# EAGLE design remote_light (EAGLE 7.2.0)
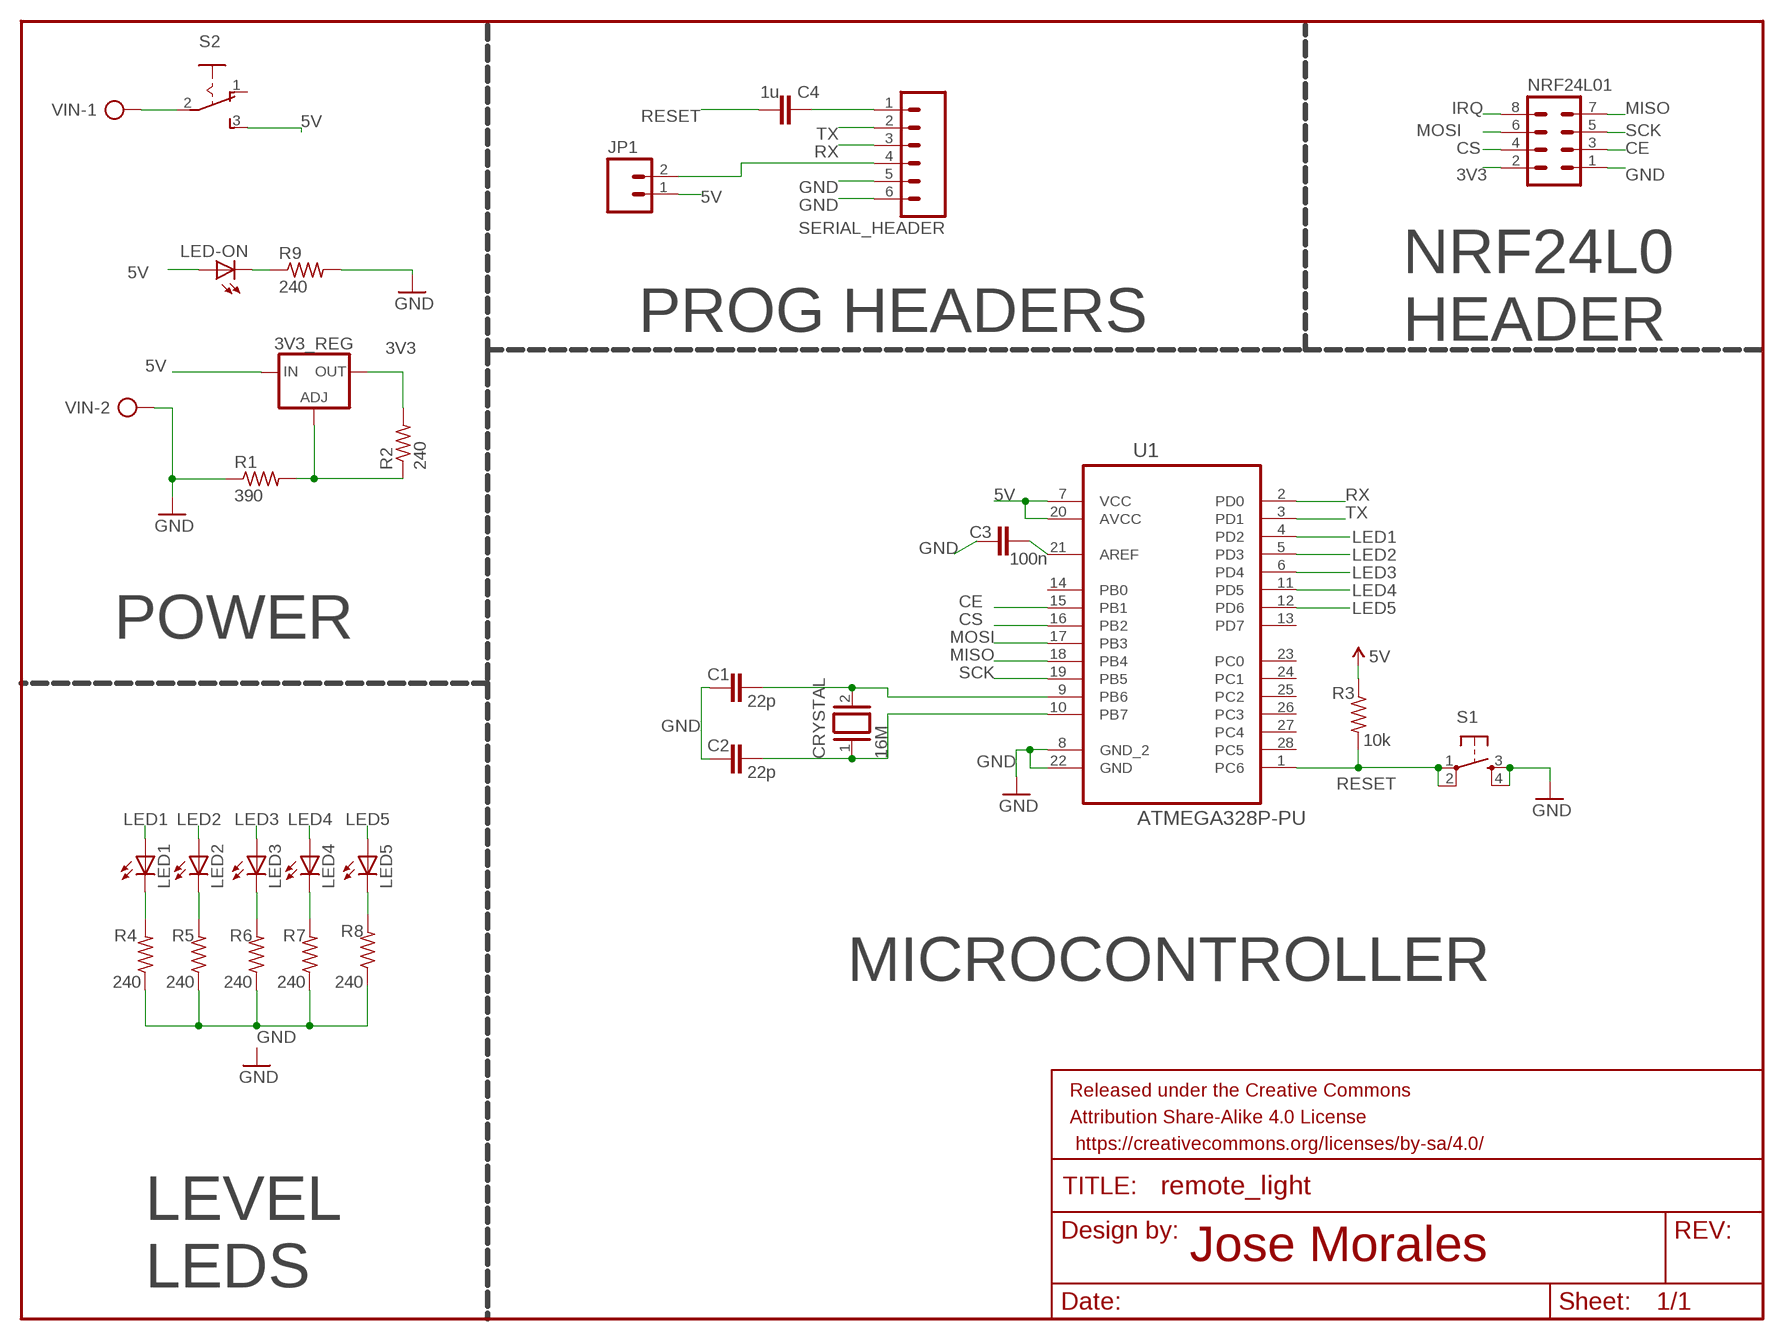
[diagram p0: schematic, sheet 1]

## Parts
C1  22p  C-EU050-025X075  [C050-025X075]
C2  22p  C-EU050-025X075  [C050-025X075]
C3  100n  C-EU050-025X075  [C050-025X075]
C4  1u  C-EU050-025X075  [C050-025X075]
CRYSTAL  16M  XTAL/S  [QS]
FRAME11  FRAME-LETTER  [CREATIVE_COMMONS]
JP1  M02LOCK  [1X02_LOCK]
LED1  LED5MM  [LED5MM]
LED2  LED5MM  [LED5MM]
LED3  LED5MM  [LED5MM]
LED4  LED5MM  [LED5MM]
LED5  LED5MM  [LED5MM]
LED-ON  LED5MM  [LED5MM]
LM317  3V3_REG  LM317TS  [317TS]
NRF24L01  MA04-2  [MA04-2]
R1  390  R-US_0207/12  [0207/12]
R2  240  R-US_0207/12  [0207/12]
R3  10k  R-US_0207/12  [0207/12]
R4  240  R-US_0207/12  [0207/12]
R5  240  R-US_0207/12  [0207/12]
R6  240  R-US_0207/12  [0207/12]
R7  240  R-US_0207/12  [0207/12]
R8  240  R-US_0207/12  [0207/12]
R9  240  R-US_0207/12  [0207/12]
S1  TAC_SWITCHPTH  [TACTILE-PTH]
S2  255SB  [255SB]
SERIAL_HEADER  M06POLAR  [MOLEX-1X6]
U1  ATMEGA328P-PU  [DIP254P762X457-28]
VIN  AK300/2  [AK300/2]

## Nets
3V3: LM317.2(OUT) NRF24L01.2 R2.2
5V: JP1.1 LED-ON.A LM317.3(IN) R3.1 S2.3(S) U1.7(VCC) U1.20(AVCC)
CE: NRF24L01.3 U1.15(PB1)
CS: NRF24L01.4 U1.16(PB2)
GND: C1.2 C2.2 C3.2 NRF24L01.1 R1.1 R4.1 R5.1 R6.1 R7.1 R8.1 R9.2 S1.3 S1.4 SERIAL_HEADER.5 SERIAL_HEADER.6 U1.8(GND_2) U1.22(GND) VIN.2
IRQ: NRF24L01.8
LED1: LED1.A U1.4(PD2)
LED2: LED2.A U1.5(PD3)
LED3: LED3.A U1.6(PD4)
LED4: LED4.A U1.11(PD5)
LED5: LED5.A U1.12(PD6)
MISO: NRF24L01.7 U1.18(PB4)
MOSI: NRF24L01.6 U1.17(PB3)
N$1: LM317.1(ADJ) R1.2 R2.1
N$2: C1.1 CRYSTAL.2 U1.9(PB6)
N$3: LED1.K(C) R4.2
N$4: LED-ON.K(C) R9.1
N$5: C2.1 CRYSTAL.1 U1.10(PB7)
N$6: LED2.K(C) R5.2
N$7: LED3.K(C) R6.2
N$8: LED4.K(C) R7.2
N$9: LED5.K(C) R8.2
N$10: C3.1 U1.21(AREF)
N$14: C4.2 SERIAL_HEADER.1
N$15: S2.2(P) VIN.1
N$17: JP1.2 SERIAL_HEADER.4
RESET: C4.1 R3.2 S1.1 S1.2 U1.1(PC6)
RX: SERIAL_HEADER.3 U1.2(PD0)
SCK: NRF24L01.5 U1.19(PB5)
TX: SERIAL_HEADER.2 U1.3(PD1)
Unconnected: S2.1(O) U1.13(PD7) U1.14(PB0) U1.23(PC0) U1.24(PC1) U1.25(PC2) U1.26(PC3) U1.27(PC4) U1.28(PC5)

## Notes on the sheet
- PROG HEADERS
- NRF24L0
  HEADER
- POWER
- MICROCONTROLLER
- Jose Morales
- LEVEL
  LEDS

## Library data of the parts
C1-C4 = rcl:C-EU: CAPACITOR, European symbol
CRYSTAL = special:XTAL/S: CRYSTAL
FRAME11 = SparkFun-Aesthetics:FRAME-LETTER: Schematic Frame Standard 8.5x11 US Letter frame; DESIGNER: NAME; VERSION: v01
JP1 = SparkFun-Connectors:M02: Standard 2-pin 0.1" header. Use with - straight break away headers ( PRT-00116) - right angle break away headers (PRT-00553) - swiss pins (PRT-00743) - machine pins (PRT-00117) - female headers (PRT-00115) Molex polarized connector foot print use with: PRT-08233 with associated crimp pins and housings. 2.54_SCREWTERM for use with PRT-10571. 3.5mm Screw Terminal footprints for PRT-08084 5mm Screw Terminal footprints for use with PRT-08432
LED1-LED5 LED-ON = led:LED: LED OSRAM: - CHIPLED LG R971, LG N971, LY N971, LG Q971, LY Q971, LO R971, LY R971 LH N974, LH R974 LS Q976, LO Q976, LY Q976 LO Q996 - Hyper CHIPLED LW Q18S LB Q993, LB Q99A, LB R99A - SideLED LS A670, LO A670, LY A670, LG A670, LP A670 LB A673, LV A673, LT A673, LW A673 LH A674 LY A675 LS A676, LA A676, LO A676, LY A676, LW A676 LS A679, LY A679, LG A679 - Hyper Micro SIDELED® LS Y876, LA Y876, LO Y876, LY Y876 LT Y87S - SmartLED LW L88C, LW L88S LB L89C, LB L89S, LG L890 LS L89K, LO L89K, LY L89K LS L896, LA L896, LO L896, LY L896 - TOPLED LS T670, LO T670, LY T670, LG T670, LP T670 LSG T670, LSP T670, LSY T670, LOP T670, LYG T670 LG T671, LOG T671, LSG T671 LB T673, LV T673, LT T673, LW T673 LH T674 LS T676, LA T676, LO T676, LY T676, LB T676, LH T676, LSB T676, LW T676 LB T67C, LV T67C, LT T67C, LS T67K, LO T67K, LY T67K, LW E67C LS E67B, LA E67B, LO E67B, LY E67B, LB E67C, LV E67C, LT E67C LW T67C LS T679, LY T679, LG T679 LS T770, LO T770, LY T770, LG T770, LP T770 LB T773, LV T773, LT T773, LW T773 LH T774 LS E675, LA E675, LY E675, LS T675 LS T776, LA T776, LO T776, LY T776, LB T776 LHGB T686 LT T68C, LB T68C - Hyper Mini TOPLED® LB M676 - Mini TOPLED Santana® LG M470 LS M47K, LO M47K, LY M47K Source: http://www.osram.convergy.de LUXEON: - LUMILED® LXK2-PW12-R00, LXK2-PW12-S00, LXK2-PW14-U00, LXK2-PW14-V00 LXK2-PM12-R00, LXK2-PM12-S00, LXK2-PM14-U00 LXK2-PE12-Q00, LXK2-PE12-R00, LXK2-PE12-S00, LXK2-PE14-T00, LXK2-PE14-U00 LXK2-PB12-K00, LXK2-PB12-L00, LXK2-PB12-M00, LXK2-PB14-N00, LXK2-PB14-P00, LXK2-PB14-Q00 LXK2-PR12-L00, LXK2-PR12-M00, LXK2-PR14-Q00, LXK2-PR14-R00 LXK2-PD12-Q00, LXK2-PD12-R00, LXK2-PD12-S00 LXK2-PH12-R00, LXK2-PH12-S00 LXK2-PL12-P00, LXK2-PL12-Q00, LXK2-PL12-R00 Source: www.luxeon.com KINGBRIGHT: KA-3528ASYC Source: www.kingbright.com
LM317 = v-reg:LM317TS: VOLTAGE REGULATOR
NRF24L01 = con-lstb:MA04-2: PIN HEADER; OC_FARNELL: unknown; OC_NEWARK: unknown
R1-R9 = resistor:R-US_: RESISTOR, American symbol
S1 = SparkFun-Retired:TAC_SWITCH: Momentary Switch Button commonly used for reset or general input. Spark Fun Electronics SKU : COM-00097 SMT- SWCH-08247
S2 = switch:255SB: SLIDING SWITCH Distributor Buerklin, 11G810
SERIAL_HEADER = SparkFun-Connectors:M06: Header 6 Standard 6-pin 0.1" header. Use with straight break away headers (SKU : PRT-00116), right angle break away headers (PRT-00553), swiss pins (PRT-00743), machine pins (PRT-00117), and female headers (PRT-00115). Molex polarized connector foot print use with SKU : PRT-08094 with associated crimp pins and housings. NOTES ON THE VARIANTS LOCK and LOCK_LONGPADS... This footprint was designed to help hold the alignment of a through-hole component (i.e. 6-pin header) while soldering it into place. You may notice that each hole has been shifted either up or down by 0.005 of an inch from it's more standard position (which is a perfectly straight line). This slight alteration caused the pins (the squares in the middle) to touch the edges of the holes. Because they are alternating, it causes a "brace" to hold the component in place. 0.005 has proven to be the perfect amount of "off-center" position when using our standard breakaway headers. Although looks a little odd when you look at the bare footprint, once you have a header in there, the alteration is very hard to notice. Also,if you push a header all the way into place, it is covered up entirely on the bottom side. This idea of altering the position of holes to aid alignment will be further integrated into the Sparkfun Library for other footprints. It can help hold any component with 3 or more connection pins.
U1 = Atmel_By_element14_Batch_1-00:ATMEGA328P-PU: 8-bit Microcontroller with In-System Programmable Flash; MPN: ATMEGA328P-PU; OC_FARNELL: 1715487; OC_NEWARK: 15R0268; PACKAGE: PDIP-28; SUPPLIER: Atmel
VIN = con-ptr500:AK300/2: CONNECTOR; OC_FARNELL: unknown; OC_NEWARK: unknown

## Net classes
0 default: clearance 0.205 mm

## Board
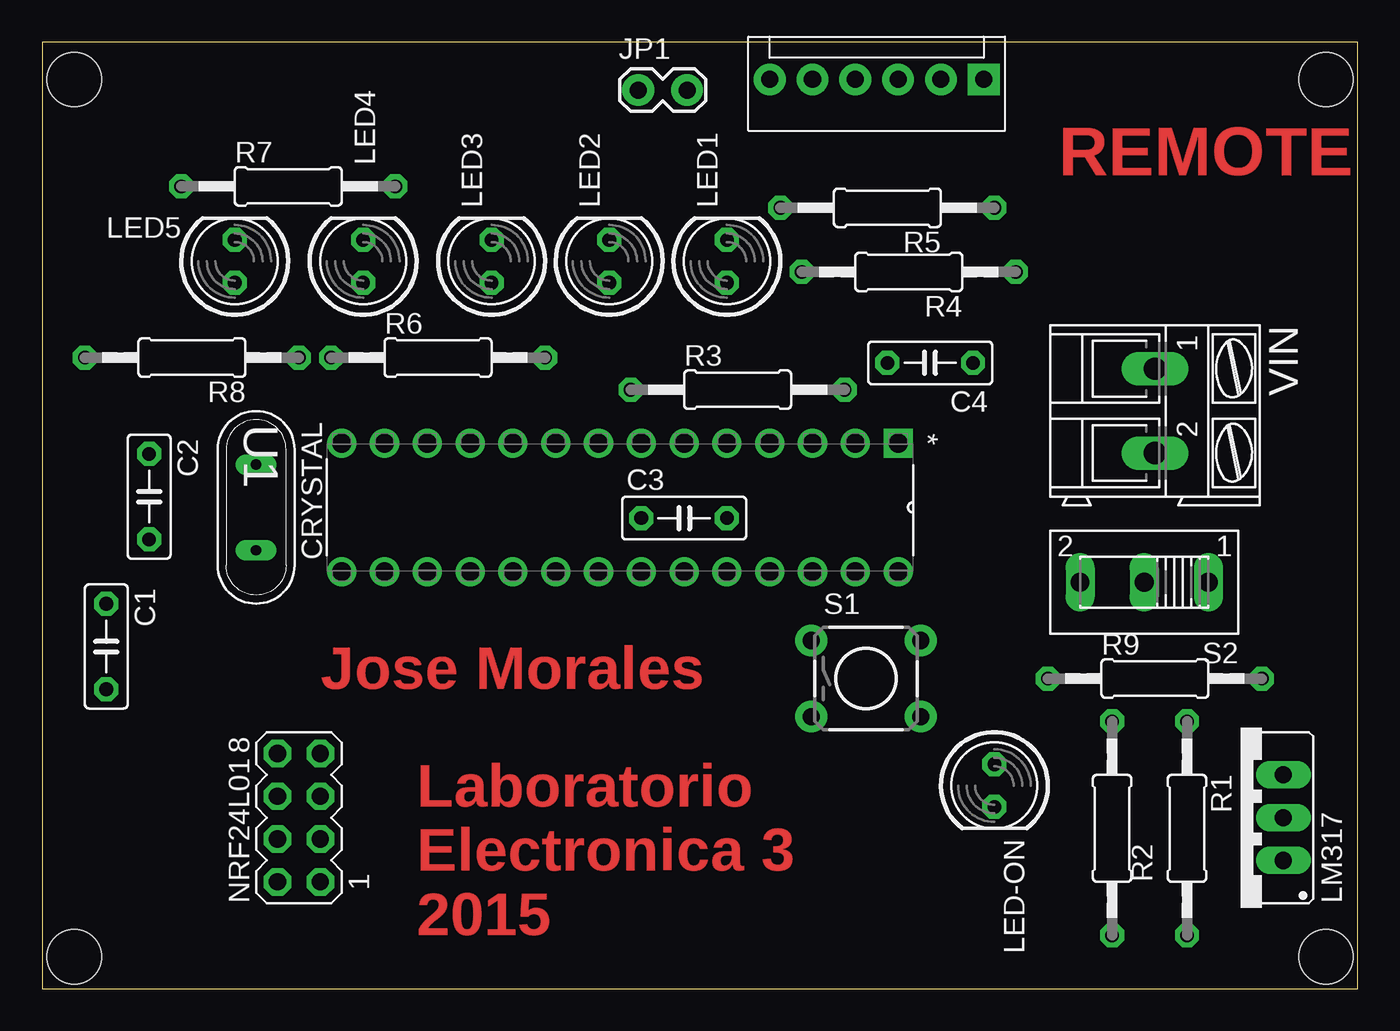
[diagram p1: board, top side]
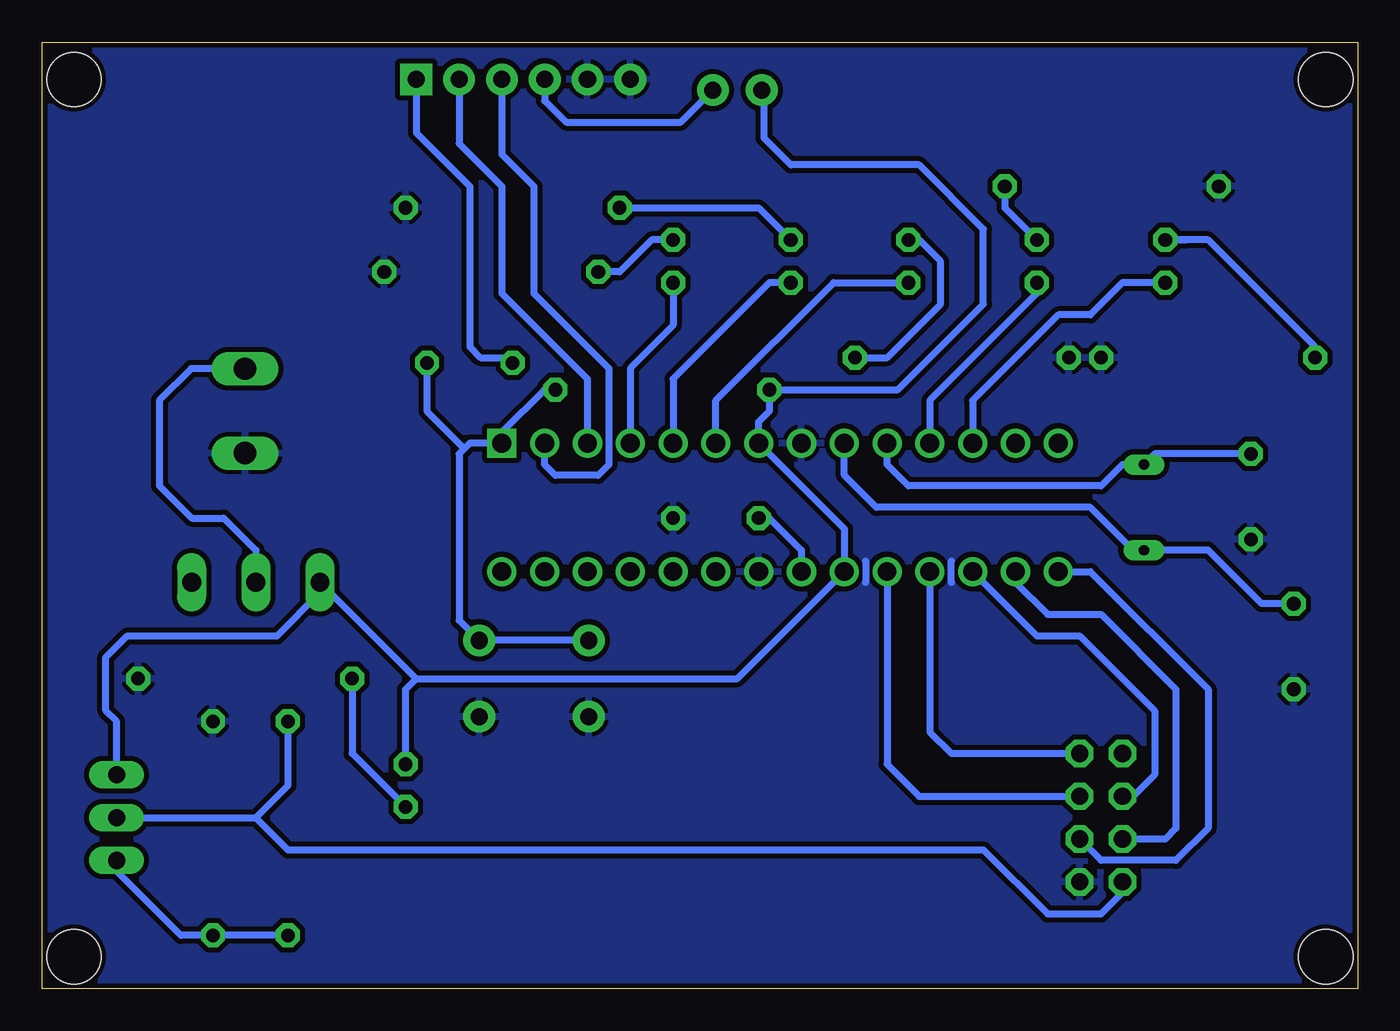
[diagram p2: board, bottom side, seen from below]

Size 78.08 x 56.19 mm. Coordinates in mm from the lower left corner, seen from the top.
Outline: 0,0 78.08,0 78.08,56.19 0,56.19 0,0
Copper layers (1*16): Top 0.035mm / dielectric 1.5mm / Bottom 0.035mm
Design rules "SparkFun *": minimum track width 8mil, minimum drill 20mil, track to track 12mil, track to pad 8mil, pad to pad 8mil, via to via 8mil, smd to smd 8mil, copper to edge 10mil, drill to drill 8mil, minimum pad ring 12mil, minimum via ring 10mil, stop-mask expansion 4mil, vias tented up to drill 25mil, thermal gap 10mil
Holes 3.2 mm at 1.91,53.98 1.91,1.91 76.2,1.91 76.2,53.98

### Footprints (pad centres in the part's own frame; a part is rotated, then mirrored left to right if it is on the bottom)
C050-025X075 = drill 0.813 octagon: 1 -2.54,0; 2 2.54,0
QS = drill 0.61 long: 1 -2.54,0; 2 2.54,0
1X02_LOCK = drill 1.016 pad 1.88: 1 -0.178,0; 2 2.718,0
LED5MM = drill 0.813 octagon: A -1.27,0; K 1.27,0
317TS = drill 1.016 long: 1 -2.54,-2.54; 2 0,-2.54; 3 2.54,-2.54
MA04-2 = drill 1.016 octagon: 1 -3.81,-1.27; 2 -3.81,1.27; 3 -1.27,-1.27; 4 -1.27,1.27; 5 1.27,-1.27; 6 1.27,1.27; 7 3.81,-1.27; 8 3.81,1.27
0207/12 = drill 0.813 octagon: 1 -6.35,0; 2 6.35,0
TACTILE-PTH = drill 1.016 pad 1.88: 1 -3.251,2.261; 2 3.251,2.261; 3 -3.251,-2.261; 4 3.251,-2.261
255SB = drill 1.118 long: 1 -3.81,0; 2 0,0; 3 3.81,0
MOLEX-1X6 = drill 1.016 pad 1.88 square: 1 0,0 | drill 1.016 pad 1.88: 2 2.54,0; 3 5.08,0; 4 7.62,0; 5 10.16,0; 6 12.7,0
DIP254P762X457-28 = drill 1.118 square: 1 -7.62,33.02 | drill 1.118: 2 -7.62,30.48; 3 -7.62,27.94; 4 -7.62,25.4; 5 -7.62,22.86; 6 -7.62,20.32; 7 -7.62,17.78; 8 -7.62,15.24; 9 -7.62,12.7; 10 -7.62,10.16; 11 -7.62,7.62; 12 -7.62,5.08; 13 -7.62,2.54; 14 -7.62,0; 15 0,0; 16 0,2.54; 17 0,5.08; 18 0,7.62; 19 0,10.16; 20 0,12.7; 21 0,15.24; 22 0,17.78; 23 0,20.32; 24 0,22.86; 25 0,25.4; 26 0,27.94; 27 0,30.48; 28 0,33.02
AK300/2 = drill 1.321 long: 1 -2.515,0; 2 2.489,0

### Placement (x,y rotation side)
C1  3.81,20.32 270 top
C2  6.35,29.21 270 top
C3  38.1,27.94 0 top
C4  52.7,37.15 180 top
CRYSTAL  12.7,28.57 270 top
FRAME11  20.95,-17.14 0 top  (outside the outline)
JP1  35.56,53.34 0 top
LED1  40.64,43.18 90 top
LED2  33.66,43.18 90 top
LED3  26.67,43.18 90 top
LED4  19.05,43.18 90 top
LED5  11.43,43.18 90 top
LED-ON  56.52,12.06 270 top
LM317  71.12,10.16 90 top
NRF24L01  15.24,10.16 90 top
R1  67.94,9.53 270 top
R2  63.5,9.53 90 top
R3  41.27,35.56 0 top
R4  51.44,42.55 180 top
R5  50.16,46.35 180 top
R6  23.5,37.47 0 top
R7  14.61,47.62 0 top
R8  8.89,37.47 180 top
R9  66.04,18.41 0 top
S1  48.9,18.41 0 top
S2  65.41,24.13 180 top
SERIAL_HEADER  55.88,53.98 180 top
U1  17.78,24.77 270 top
VIN  66.04,34.29 270 top

### Tracks (layer width: path | path; a pad name or v marks a point on that pad's centre or on a via)
3V3
  Bottom 0.406: NRF24L01.2 13.97,5.71 15.24,4.45 18.41,4.45 22.23,8.26 63.5,8.26 65.41,10.16 | LM317.2 65.41,10.16 | R2.2 63.5,12.06 65.41,10.16
5V
  Bottom 0.406: 55.88,18.41 36.83,18.41 U1.20 30.48,27.3 U1.7 35.56,33.66 34.92,34.29 R3.1 27.3,35.56 22.23,40.64 22.23,45.09 26.04,48.9 33.66,48.9 35.24,50.48 35.24,53.2 JP1.1 | 55.88,18.41 S2.3 61.59,23.5 64.14,20.95 73.03,20.95 74.3,19.68 74.3,16.51 73.66,15.88 LM317.3 | LED-ON.A 56.52,17.78 55.88,18.41
CE
  Bottom 0.406: U1.15 15.88,24.77 8.89,17.78 8.89,9.53 10.79,7.62 15.24,7.62 NRF24L01.3
CS
  Bottom 0.406: U1.16 20.32,24.13 18.41,22.23 15.24,22.23 10.79,17.78 10.79,9.53 11.43,8.89 NRF24L01.4
GND
  Bottom 0.406: 24.13,24.13 24.13,25.4 | 29.21,25.4 29.21,24.13
  pour Bottom (isolate 0.305): 0,57.15 83.82,57.15 83.82,-9.53 0,-9.53
LED1
  Bottom 0.406: LED1.A 40.64,39.37 43.18,36.83 U1.4
LED2
  Bottom 0.406: LED2.A 34.92,41.91 40.64,36.2 U1.5
LED3
  Bottom 0.406: U1.6 38.1,34.92 31.11,41.91 LED3.A
LED4
  Bottom 0.406: LED4.A 19.05,41.27 25.4,34.92 U1.11
LED5
  Bottom 0.406: LED5.A 13.97,41.91 15.88,40.01 17.78,40.01 22.86,34.92 U1.12
MISO
  Bottom 0.406: U1.18 25.4,15.24 24.13,13.97 NRF24L01.7
MOSI
  Bottom 0.406: U1.17 19.05,20.95 16.51,20.95 12.06,16.51 12.06,12.7 13.34,11.43 NRF24L01.6
N$1
  Bottom 0.406: R2.1 R1.2 69.85,3.17 73.66,6.99 LM317.1
N$2
  Bottom 0.406: U1.9 30.48,30.48 28.57,28.57 15.88,28.57 13.34,26.04 CRYSTAL.2 8.89,26.04 5.71,22.86 C1.1
N$3
  Bottom 0.406: LED1.K 41.91,44.45 43.81,42.55 R4.2
N$4
  Bottom 0.406: R9.1 59.69,13.97 LED-ON.K
N$5
  Bottom 0.406: C2.1 12.06,31.75 CRYSTAL.1 13.97,31.11 15.24,29.84 26.67,29.84 27.94,31.11 U1.10
N$6
  Bottom 0.406: R5.2 35.56,46.35 LED2.K
N$7
  Bottom 0.406: R6.2 27.94,37.47 24.77,40.64 24.77,43.18 26.04,44.45 LED3.K
N$8
  Bottom 0.406: R7.2 20.95,46.35 LED4.K
N$9
  Bottom 0.406: 10.16,44.45 LED5.K 8.89,44.45 2.54,38.1 R8.2
N$10
  Bottom 0.406: C3.1 34.92,27.94 33.02,26.04 U1.21
N$13
  pour Bottom: 28.57,6.99 60.33,7.62 60.33,3.17 28.57,2.54
N$14
  Bottom 0.406: SERIAL_HEADER.1 55.88,50.8 52.7,47.62 52.7,38.1 52.07,37.47 50.48,37.47 C4.2
N$15
  Bottom 0.406: VIN.1 69.24,36.8 71.12,34.92 71.12,29.84 69.22,27.94 67.31,27.94 65.41,26.04 S2.2
N$16
  pour Bottom: 27.3,17.14 45.09,17.14 45.09,8.89 27.3,8.89
N$17
  Bottom 0.406: SERIAL_HEADER.4 48.26,52.7 46.99,51.44 40.18,51.44 JP1.2
RESET
  Bottom 0.406: S1.1 S1.2 53.34,21.87 53.34,31.75 53.02,32.07 | R3.2 48.26,35.56 50.8,33.02 U1.1 52.7,32.38 53.02,32.07 | C4.1 55.24,34.29 53.02,32.07
RX
  Bottom 0.406: SERIAL_HEADER.3 50.8,49.53 48.9,47.62 48.9,41.27 44.45,36.83 44.45,31.11 45.09,30.48 47.62,30.48 48.26,31.11 U1.2
SCK
  Bottom 0.406: U1.19 27.94,13.34 26.04,11.43 NRF24L01.5
TX
  Bottom 0.406: SERIAL_HEADER.2 53.34,50.16 50.8,47.62 50.8,41.27 45.72,36.2 U1.3

### Text on the board
Top: REMOTE | Jose Morales | Laboratorio / Electronica 3 / 2015
bRestrict: LAB.E3 / 2015 | Jose Morales
_tplace: 1 | 2 | * | 2 | 1 | 8 | 1